# Altium schematic sheet USB_SATA.SchDoc
size B; SheetNumber: 6; SheetTotal: 11
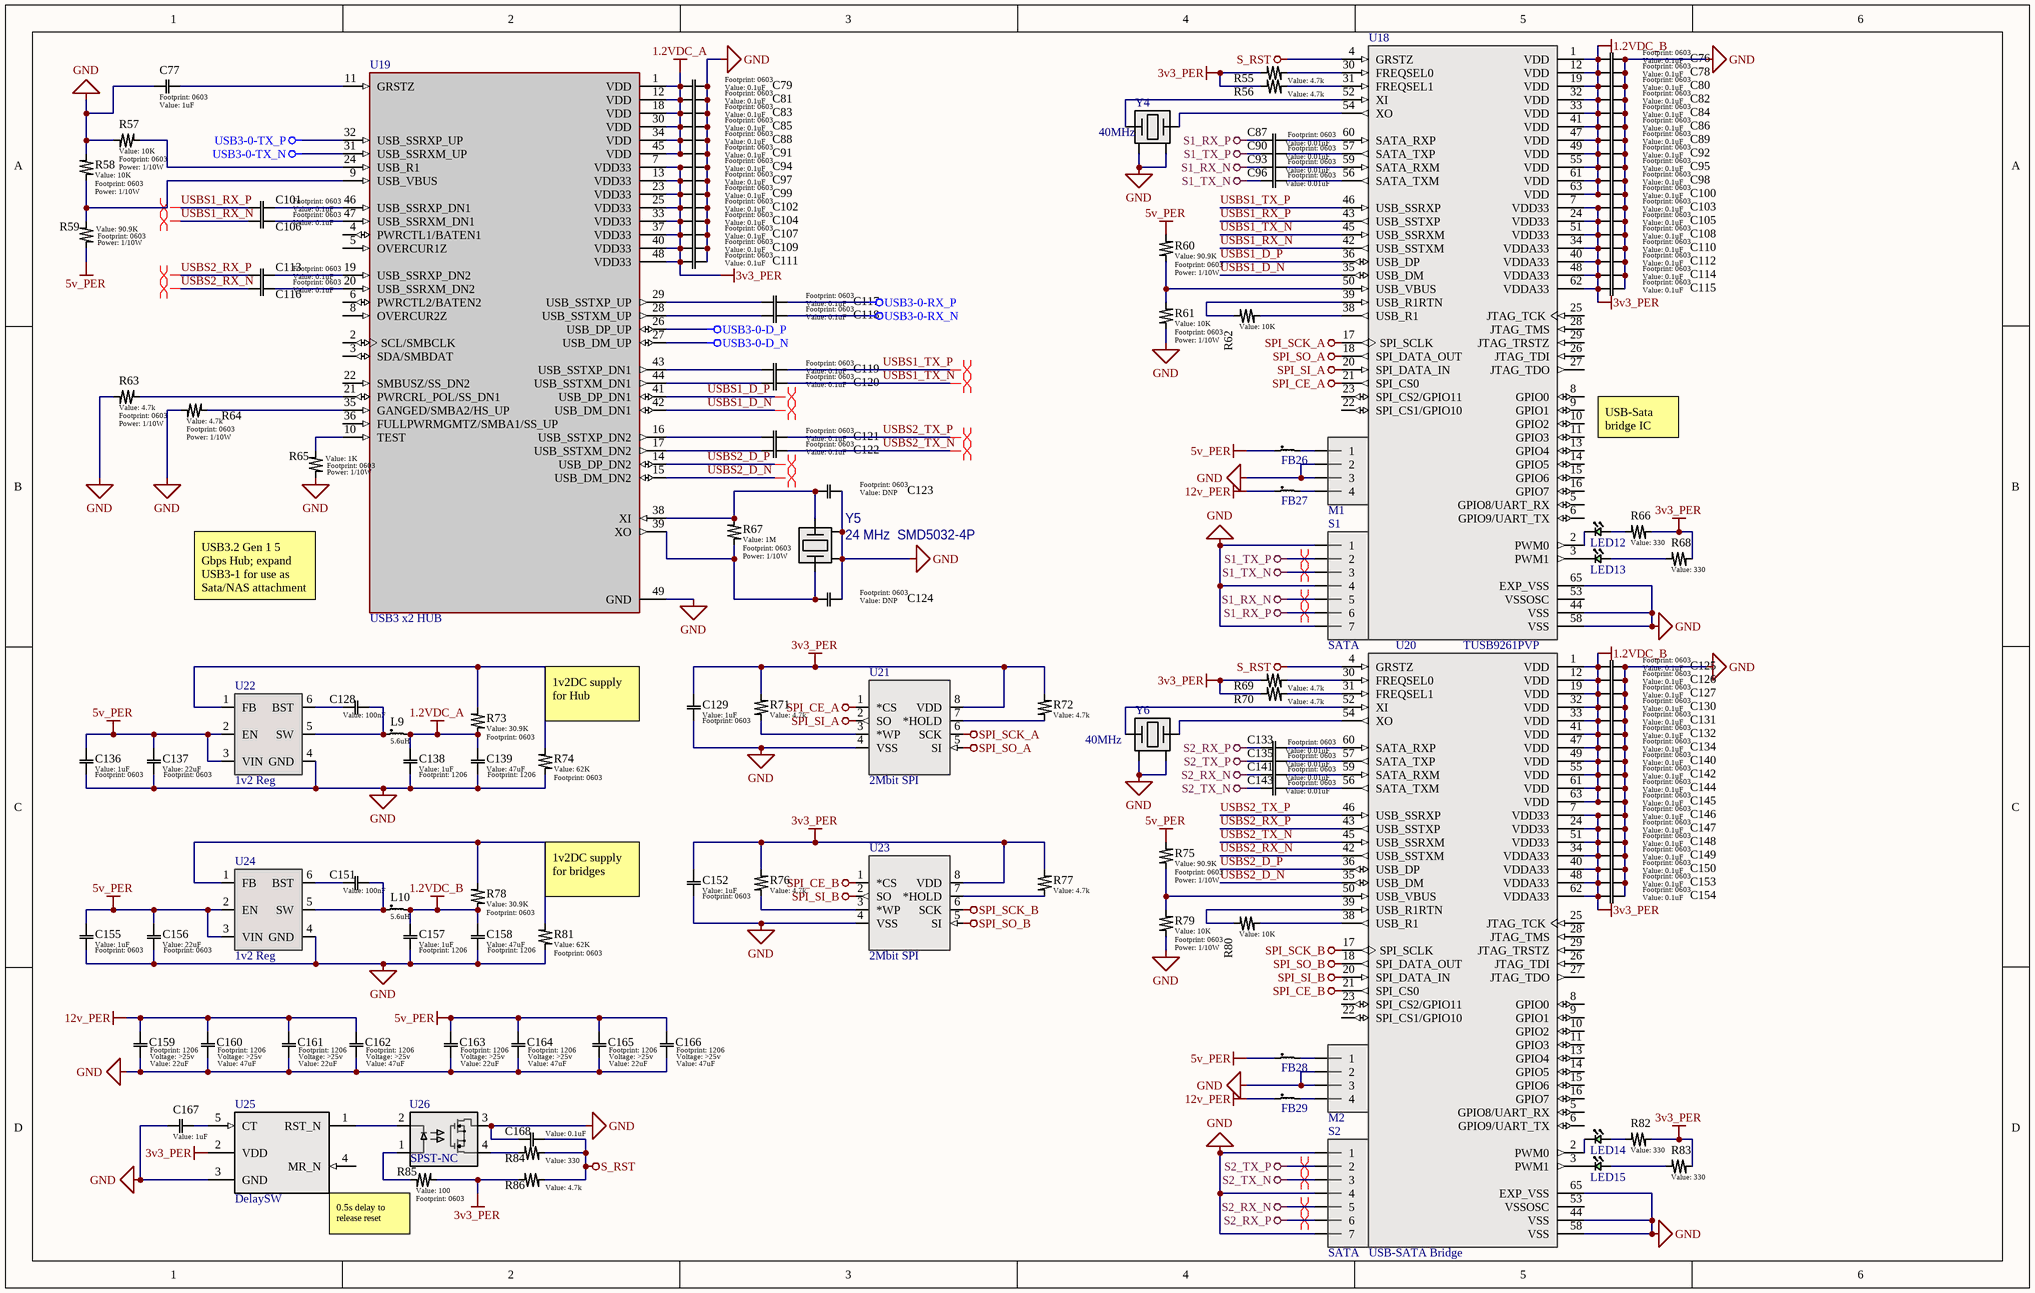
[diagram p0: USB_SATA.SchDoc]

## Parts
C76  value 0.1uF  [0603]  (hidden comment: Generic Capacitor)
C77  value 1uF  [0603]  (hidden comment: Generic Capacitor)
C78  value 0.1uF  [0603]  (hidden comment: Generic Capacitor)
C79  value 0.1uF  [0603]  (hidden comment: Generic Capacitor)
C80  value 0.1uF  [0603]  (hidden comment: Generic Capacitor)
C81  value 0.1uF  [0603]  (hidden comment: Generic Capacitor)
C82  value 0.1uF  [0603]  (hidden comment: Generic Capacitor)
C83  value 0.1uF  [0603]  (hidden comment: Generic Capacitor)
C84  value 0.1uF  [0603]  (hidden comment: Generic Capacitor)
C85  value 0.1uF  [0603]  (hidden comment: Generic Capacitor)
C86  value 0.1uF  [0603]  (hidden comment: Generic Capacitor)
C87  value 0.01uF  [0603]  (hidden comment: Generic Capacitor)
C88  value 0.1uF  [0603]  (hidden comment: Generic Capacitor)
C89  value 0.1uF  [0603]  (hidden comment: Generic Capacitor)
C90  value 0.01uF  [0603]  (hidden comment: Generic Capacitor)
C91  value 0.1uF  [0603]  (hidden comment: Generic Capacitor)
C92  value 0.1uF  [0603]  (hidden comment: Generic Capacitor)
C93  value 0.01uF  [0603]  (hidden comment: Generic Capacitor)
C94  value 0.1uF  [0603]  (hidden comment: Generic Capacitor)
C95  value 0.1uF  [0603]  (hidden comment: Generic Capacitor)
C96  value 0.01uF  [0603]  (hidden comment: Generic Capacitor)
C97  value 0.1uF  [0603]  (hidden comment: Generic Capacitor)
C98  value 0.1uF  [0603]  (hidden comment: Generic Capacitor)
C99  value 0.1uF  [0603]  (hidden comment: Generic Capacitor)
C100  value 0.1uF  [0603]  (hidden comment: Generic Capacitor)
C101  value 0.1uF  [0603]  (hidden comment: Generic Capacitor)
C102  value 0.1uF  [0603]  (hidden comment: Generic Capacitor)
C103  value 0.1uF  [0603]  (hidden comment: Generic Capacitor)
C104  value 0.1uF  [0603]  (hidden comment: Generic Capacitor)
C105  value 0.1uF  [0603]  (hidden comment: Generic Capacitor)
C106  value 0.1uF  [0603]  (hidden comment: Generic Capacitor)
C107  value 0.1uF  [0603]  (hidden comment: Generic Capacitor)
C108  value 0.1uF  [0603]  (hidden comment: Generic Capacitor)
C109  value 0.1uF  [0603]  (hidden comment: Generic Capacitor)
C110  value 0.1uF  [0603]  (hidden comment: Generic Capacitor)
C111  value 0.1uF  [0603]  (hidden comment: Generic Capacitor)
C112  value 0.1uF  [0603]  (hidden comment: Generic Capacitor)
C113  value 0.1uF  [0603]  (hidden comment: Generic Capacitor)
C114  value 0.1uF  [0603]  (hidden comment: Generic Capacitor)
C115  value 0.1uF  [0603]  (hidden comment: Generic Capacitor)
C116  value 0.1uF  [0603]  (hidden comment: Generic Capacitor)
C117  value 0.1uF  [0603]  (hidden comment: Generic Capacitor)
C118  value 0.1uF  [0603]  (hidden comment: Generic Capacitor)
C119  value 0.1uF  [0603]  (hidden comment: Generic Capacitor)
C120  value 0.1uF  [0603]  (hidden comment: Generic Capacitor)
C121  value 0.1uF  [0603]  (hidden comment: Generic Capacitor)
C122  value 0.1uF  [0603]  (hidden comment: Generic Capacitor)
C123  value DNP  [0603]  (hidden comment: Generic Capacitor)
C124  value DNP  [0603]  (hidden comment: Generic Capacitor)
C125  value 0.1uF  [0603]  (hidden comment: Generic Capacitor)
C126  value 0.1uF  [0603]  (hidden comment: Generic Capacitor)
C127  value 0.1uF  [0603]  (hidden comment: Generic Capacitor)
C128  value 100nF  [0603]  (hidden comment: Generic Capacitor)
C129  value 1uF  [0603]  (hidden comment: Generic Capacitor)
C130  value 0.1uF  [0603]  (hidden comment: Generic Capacitor)
C131  value 0.1uF  [0603]  (hidden comment: Generic Capacitor)
C132  value 0.1uF  [0603]  (hidden comment: Generic Capacitor)
C133  value 0.01uF  [0603]  (hidden comment: Generic Capacitor)
C134  value 0.1uF  [0603]  (hidden comment: Generic Capacitor)
C135  value 0.01uF  [0603]  (hidden comment: Generic Capacitor)
C136  value 1uF  [0603]  (hidden comment: Generic Capacitor)
C137  value 22uF  [0603]  (hidden comment: Generic Capacitor)
C138  value 1uF  [1206]  (hidden comment: Generic Capacitor)
C139  value 47uF  [1206]  (hidden comment: Generic Capacitor)
C140  value 0.1uF  [0603]  (hidden comment: Generic Capacitor)
C141  value 0.01uF  [0603]  (hidden comment: Generic Capacitor)
C142  value 0.1uF  [0603]  (hidden comment: Generic Capacitor)
C143  value 0.01uF  [0603]  (hidden comment: Generic Capacitor)
C144  value 0.1uF  [0603]  (hidden comment: Generic Capacitor)
C145  value 0.1uF  [0603]  (hidden comment: Generic Capacitor)
C146  value 0.1uF  [0603]  (hidden comment: Generic Capacitor)
C147  value 0.1uF  [0603]  (hidden comment: Generic Capacitor)
C148  value 0.1uF  [0603]  (hidden comment: Generic Capacitor)
C149  value 0.1uF  [0603]  (hidden comment: Generic Capacitor)
C150  value 0.1uF  [0603]  (hidden comment: Generic Capacitor)
C151  value 100nF  [0603]  (hidden comment: Generic Capacitor)
C152  value 1uF  [0603]  (hidden comment: Generic Capacitor)
C153  value 0.1uF  [0603]  (hidden comment: Generic Capacitor)
C154  value 0.1uF  [0603]  (hidden comment: Generic Capacitor)
C155  value 1uF  [0603]  (hidden comment: Generic Capacitor)
C156  value 22uF  [0603]  (hidden comment: Generic Capacitor)
C157  value 1uF  [1206]  (hidden comment: Generic Capacitor)
C158  value 47uF  [1206]  (hidden comment: Generic Capacitor)
C159  value 22uF  Voltage: >25v  [1206]  (hidden comment: Generic Capacitor)
C160  value 47uF  Voltage: >25v  [1206]  (hidden comment: Generic Capacitor)
C161  value 22uF  Voltage: >25v  [1206]  (hidden comment: Generic Capacitor)
C162  value 47uF  Voltage: >25v  [1206]  (hidden comment: Generic Capacitor)
C163  value 22uF  Voltage: >25v  [1206]  (hidden comment: Generic Capacitor)
C164  value 47uF  Voltage: >25v  [1206]  (hidden comment: Generic Capacitor)
C165  value 22uF  Voltage: >25v  [1206]  (hidden comment: Generic Capacitor)
C166  value 47uF  Voltage: >25v  [1206]  (hidden comment: Generic Capacitor)
C167  value 1uF  [0603]  (hidden comment: Generic Capacitor)
C168  value 0.1uF  [0603]  (hidden comment: Generic Capacitor)
FB26  1206 Ferrite  [1206]  (value not drawn)
FB27  1206 Ferrite  [1206]  (value not drawn)
FB28  1206 Ferrite  [1206]  (value not drawn)
FB29  1206 Ferrite  [1206]  (value not drawn)
L9  5.6uH  [TMPC0402HP]
L10  5.6uH  [TMPC0402HP]
LED12  LTST-C191KGKT  [0603 (1608 Metric) Concave]  (value not drawn)
LED13  LTST-C191KGKT  [0603 (1608 Metric) Concave]  (value not drawn)
LED14  LTST-C191KGKT  [0603 (1608 Metric) Concave]  (value not drawn)
LED15  LTST-C191KGKT  [0603 (1608 Metric) Concave]  (value not drawn)
M1  MATE-n-Lock  [794287-1]  (value not drawn)
M2  MATE-n-Lock  [794287-1]  (value not drawn)
R55  value 4.7k  [0603]  (hidden comment: Generic Resistor)
R56  value 4.7k  [0603]  (hidden comment: Generic Resistor)
R57  value 10K  Power: 1/10W  [0603]  (hidden comment: Generic Resistor)
R58  value 10K  Power: 1/10W  [0603]  (hidden comment: Generic Resistor)
R59  value 90.9K  Power: 1/10W  [0603]  (hidden comment: Generic Resistor)
R60  value 90.9K  Power: 1/10W  [0603]  (hidden comment: Generic Resistor)
R61  value 10K  Power: 1/10W  [0603]  (hidden comment: Generic Resistor)
R62  value 10K  [0603]  (hidden comment: Generic Resistor)
R63  value 4.7k  Power: 1/10W  [0603]  (hidden comment: Generic Resistor)
R64  value 4.7k  Power: 1/10W  [0603]  (hidden comment: Generic Resistor)
R65  value 1K  Power: 1/10W  [0603]  (hidden comment: Generic Resistor)
R66  value 330  [0603]  (hidden comment: Generic Resistor)
R67  value 1M  Power: 1/10W  [0603]  (hidden comment: Generic Resistor)
R68  value 330  [0603]  (hidden comment: Generic Resistor)
R69  value 4.7k  [0603]  (hidden comment: Generic Resistor)
R70  value 4.7k  [0603]  (hidden comment: Generic Resistor)
R71  value 4.7k  [0603]  (hidden comment: Generic Resistor)
R72  value 4.7k  [0603]  (hidden comment: Generic Resistor)
R73  value 30.9K  [0603]  (hidden comment: Generic Resistor)
R74  value 62K  [0603]  (hidden comment: Generic Resistor)
R75  value 90.9K  Power: 1/10W  [0603]  (hidden comment: Generic Resistor)
R76  value 4.7k  [0603]  (hidden comment: Generic Resistor)
R77  value 4.7k  [0603]  (hidden comment: Generic Resistor)
R78  value 30.9K  [0603]  (hidden comment: Generic Resistor)
R79  value 10K  Power: 1/10W  [0603]  (hidden comment: Generic Resistor)
R80  value 10K  [0603]  (hidden comment: Generic Resistor)
R81  value 62K  [0603]  (hidden comment: Generic Resistor)
R82  value 330  [0603]  (hidden comment: Generic Resistor)
R83  value 330  [0603]  (hidden comment: Generic Resistor)
R84  value 330  [0603]  (hidden comment: Generic Resistor)
R85  value 100  [0603]  (hidden comment: Generic Resistor)
R86  value 4.7k  [0603]  (hidden comment: Generic Resistor)
S1  SATA  [67800-8025]
S2  SATA  [67800-8025]
U18  USB-SATA Bridge  [64-HTQFP (7x7)]  (value not drawn)
U19  USB3 x2 HUB  [HTQFP-48(7x7)]
U20  USB-SATA Bridge  [64-HTQFP (7x7)]
U21  2Mbit SPI  [8-SOIC (0.154", 3.90mm Width)]
U22  1v2 Reg  [TSOT-23-6]
U23  2Mbit SPI  [8-SOIC (0.154", 3.90mm Width)]
U24  1v2 Reg  [TSOT-23-6]
U25  DelaySW  [TSOT-23-5]
U26  SPST-NC  [4-SOP]
Y4  40MHz  [SMD3225-4P]
Y5  24 MHz  SMD5032-4P  [ECS-240-18-30BQ-DS]
Y6  40MHz  [SMD3225-4P]

## Nets
1.2VDC_A: C79.2 C81.2 C83.2 C85.2 C88.2 C91.2 C138.1 C139.1 L9.2 R73.1 U19.1(VDD) U19.12(VDD) U19.18(VDD) U19.30(VDD) U19.34(VDD) U19.45(VDD)
1.2VDC_B: C76.2 C78.2 C80.2 C82.2 C84.2 C86.2 C89.2 C92.2 C95.2 C98.2 C100.2 C125.2 C126.2 C127.2 C130.2 C131.2 C132.2 C134.2 C140.2 C142.2 C144.2 C145.2 C157.1 C158.1 L10.2 R78.1 U18.1(VDD) U18.12(VDD) U18.19(VDD) U18.32(VDD) U18.33(VDD) U18.41(VDD) U18.47(VDD) U18.49(VDD) U18.55(VDD) U18.61(VDD) U18.63(VDD) U20.1(VDD) U20.12(VDD) U20.19(VDD) U20.32(VDD) U20.33(VDD) U20.41(VDD) U20.47(VDD) U20.49(VDD) U20.55(VDD) U20.61(VDD) U20.63(VDD)
3v3_PER: C94.2 C97.2 C99.2 C102.2 C103.2 C104.2 C105.2 C107.2 C108.2 C109.2 C110.2 C111.2 C112.2 C114.2 C115.2 C129.1 C146.2 C147.2 C148.2 C149.2 C150.2 C152.1 C153.2 C154.2 R55.1 R56.1 R66.2 R68.2 R69.1 R70.1 R71.1 R72.1 R76.1 R77.1 R82.2 R83.2 R85.2 R86.1 U18.7(VDD33) U18.24(VDD33) U18.34(VDDA33) U18.40(VDDA33) U18.48(VDDA33) U18.51(VDD33) U18.62(VDDA33) U19.7(VDD33) U19.13(VDD33) U19.23(VDD33) U19.25(VDD33) U19.33(VDD33) U19.37(VDD33) U19.40(VDD33) U19.48(VDD33) U20.7(VDD33) U20.24(VDD33) U20.34(VDDA33) U20.40(VDDA33) U20.48(VDDA33) U20.51(VDD33) U20.62(VDDA33) U21.8(VDD) U23.8(VDD) U25.2(VDD)
5v_PER: C136.1 C137.1 C155.1 C156.1 C163.1 C164.1 C165.1 C166.1 FB26.1 FB28.1 R59.1 R60.1 R75.1 U22.2(EN) U22.3(VIN) U24.2(EN) U24.3(VIN)
12v_PER: C159.1 C160.1 C161.1 C162.1 FB27.1 FB29.1
GND: C76.1 C77.1 C78.1 C79.1 C80.1 C81.1 C82.1 C83.1 C84.1 C85.1 C86.1 C88.1 C89.1 C91.1 C92.1 C94.1 C95.1 C97.1 C98.1 C99.1 C100.1 C102.1 C103.1 C104.1 C105.1 C107.1 C108.1 C109.1 C110.1 C111.1 C112.1 C114.1 C115.1 C123.1 C124.1 C125.1 C126.1 C127.1 C129.2 C130.1 C131.1 C132.1 C134.1 C136.2 C137.2 C138.2 C139.2 C140.1 C142.1 C144.1 C145.1 C146.1 C147.1 C148.1 C149.1 C150.1 C152.2 C153.1 C154.1 C155.2 C156.2 C157.2 C158.2 C159.2 C160.2 C161.2 C162.2 C163.2 C164.2 C165.2 C166.2 C167.2 C168.1 M1.2 M1.3 M2.2 M2.3 R57.1 R58.1 R61.1 R63.1 R64.1 R65.1 R74.1 R79.1 R81.1 S1.1 S1.4 S1.7 S2.1 S2.4 S2.7 U18.44(VSS) U18.58(VSS) U18.65(EXP_VSS) U19.49(GND) U20.44(VSS) U20.58(VSS) U20.65(EXP_VSS) U21.4(VSS) U22.4(GND) U23.4(VSS) U24.4(GND) U25.3(GND) U26.3 Y4.2(GND) Y4.4(GND) Y5.2(GND) Y5.4(GND) Y6.2(GND) Y6.4(GND)
S1_RX_N: C93.2 S1.5
S1_RX_P: C87.2 S1.6
S1_TX_N: C96.2 S1.3
S1_TX_P: C90.2 S1.2
S2_RX_N: C141.2 S2.5
S2_RX_P: C133.2 S2.6
S2_TX_N: C143.2 S2.3
S2_TX_P: C135.2 S2.2
S_RST: C168.2 R84.2 R86.2 U18.4(GRSTZ) U20.4(GRSTZ)
SPI_CE_A: U18.21(SPI_CS0) U21.1(*CS)
SPI_CE_B: U20.21(SPI_CS0) U23.1(*CS)
SPI_SCK_A: U18.17(SPI_SCLK) U21.6(SCK)
SPI_SCK_B: U20.17(SPI_SCLK) U23.6(SCK)
SPI_SI_A: U18.20(SPI_DATA_IN) U21.2(SO)
SPI_SI_B: U20.20(SPI_DATA_IN) U23.2(SO)
SPI_SO_A: U18.18(SPI_DATA_OUT) U21.5(SI)
SPI_SO_B: U20.18(SPI_DATA_OUT) U23.5(SI)
USB3-0-D_N: U19.27(USB_DM_UP)
USB3-0-D_P: U19.26(USB_DP_UP)
USB3-0-RX_N: C118.1
USB3-0-RX_P: C117.1
USB3-0-TX_N: U19.31(USB_SSRXM_UP)
USB3-0-TX_P: U19.32(USB_SSRXP_UP)
USBS1_D_N: U18.35(USB_DM) U19.42(USB_DM_DN1)
USBS1_D_P: U18.36(USB_DP) U19.41(USB_DP_DN1)
USBS1_RX_N: C106.2 U18.42(USB_SSTXM)
USBS1_RX_P: C101.2 U18.43(USB_SSTXP)
USBS1_TX_N: C120.1 U18.45(USB_SSRXM)
USBS1_TX_P: C119.1 U18.46(USB_SSRXP)
USBS2_D_N: U19.15(USB_DM_DN2) U20.35(USB_DM)
USBS2_D_P: U19.14(USB_DP_DN2) U20.36(USB_DP)
USBS2_RX_N: C116.2 U20.42(USB_SSTXM)
USBS2_RX_P: C113.2 U20.43(USB_SSTXP)
USBS2_TX_N: C122.1 U20.45(USB_SSRXM)
USBS2_TX_P: C121.1 U20.46(USB_SSRXP)
NetC77_2: C77.2 U19.11(GRSTZ)
NetC87_1: C87.1 U18.60(SATA_RXP)
NetC90_1: C90.1 U18.57(SATA_TXP)
NetC93_1: C93.1 U18.59(SATA_RXM)
NetC96_1: C96.1 U18.56(SATA_TXM)
NetC101_1: C101.1 U19.46(USB_SSRXP_DN1)
NetC106_1: C106.1 U19.47(USB_SSRXM_DN1)
NetC113_1: C113.1 U19.19(USB_SSRXP_DN2)
NetC116_1: C116.1 U19.20(USB_SSRXM_DN2)
NetC117_2: C117.2 U19.29(USB_SSTXP_UP)
NetC118_2: C118.2 U19.28(USB_SSTXM_UP)
NetC119_2: C119.2 U19.43(USB_SSTXP_DN1)
NetC120_2: C120.2 U19.44(USB_SSTXM_DN1)
NetC121_2: C121.2 U19.16(USB_SSTXP_DN2)
NetC122_2: C122.2 U19.17(USB_SSTXM_DN2)
NetC123_2: C123.2 R67.1 U19.38(XI) Y5.3
NetC124_2: C124.2 R67.2 U19.39(XO) Y5.1
NetC128_1: C128.1 U22.6(BST)
NetC128_2: C128.2 L9.1 U22.5(SW)
NetC133_1: C133.1 U20.60(SATA_RXP)
NetC135_1: C135.1 U20.57(SATA_TXP)
NetC141_1: C141.1 U20.59(SATA_RXM)
NetC143_1: C143.1 U20.56(SATA_TXM)
NetC151_1: C151.1 U24.6(BST)
NetC151_2: C151.2 L10.1 U24.5(SW)
NetC167_1: C167.1 U25.5(CT)
NetFB26_2: FB26.2 M1.1
NetFB27_2: FB27.2 M1.4
NetFB28_2: FB28.2 M2.1
NetFB29_2: FB29.2 M2.4
NetLED12_1: LED12.1(Cathode) U18.2(PWM0)
NetLED12_2: LED12.2(Anode) R66.1
NetLED13_1: LED13.1(Cathode) U18.3(PWM1)
NetLED13_2: LED13.2(Anode) R68.1
NetLED14_1: LED14.1(Cathode) U20.2(PWM0)
NetLED14_2: LED14.2(Anode) R82.1
NetLED15_1: LED15.1(Cathode) U20.3(PWM1)
NetLED15_2: LED15.2(Anode) R83.1
NetR55_2: R55.2 U18.30(FREQSEL0)
NetR56_2: R56.2 U18.31(FREQSEL1)
NetR57_2: R57.2 U19.24(USB_R1)
NetR58_2: R58.2 R59.2 U19.9(USB_VBUS)
NetR60_2: R60.2 R61.2 U18.50(USB_VBUS)
NetR62_1: R62.1 U18.39(USB_R1RTN)
NetR62_2: R62.2 U18.38(USB_R1)
NetR63_2: R63.2 U19.21(PWRCRL_POL/SS_DN1)
NetR64_2: R64.2 U19.35(GANGED/SMBA2/HS_UP)
NetR65_2: R65.2 U19.10(TEST)
NetR69_2: R69.2 U20.30(FREQSEL0)
NetR70_2: R70.2 U20.31(FREQSEL1)
NetR71_2: R71.2 U21.3(*WP)
NetR72_2: R72.2 U21.7(*HOLD)
NetR73_2: R73.2 R74.2 U22.1(FB)
NetR75_2: R75.2 R79.2 U20.50(USB_VBUS)
NetR76_2: R76.2 U23.3(*WP)
NetR77_2: R77.2 U23.7(*HOLD)
NetR78_2: R78.2 R81.2 U24.1(FB)
NetR80_1: R80.1 U20.39(USB_R1RTN)
NetR80_2: R80.2 U20.38(USB_R1)
NetR84_1: R84.1 U26.4
NetR85_1: R85.1 U26.1
NetU18_52: U18.52(XI) Y4.3
NetU18_54: U18.54(XO) Y4.1
NetU20_52: U20.52(XI) Y6.3
NetU20_54: U20.54(XO) Y6.1
NetU25_1: U25.1(RST_N) U26.2

Not connected (* = marked no-connect by the designer): U18 5(GPIO8/UART_RX) 6(GPIO9/UART_TX) 8(GPIO0) 9(GPIO1) 10(GPIO2) 11(GPIO3) 13(GPIO4) 14(GPIO5) 15(GPIO6) 16(GPIO7) 22(SPI_CS1/GPIO10) 23(SPI_CS2/GPIO11) 25(JTAG_TCK) 26(JTAG_TDI) 27(JTAG_TDO) 28(JTAG_TMS) 29(JTAG_TRSTZ) 53(VSSOSC); U19 2(SCL/SMBCLK) 3(SDA/SMBDAT) 4(PWRCTL1/BATEN1) 5(OVERCUR1Z) 6(PWRCTL2/BATEN2) 8(OVERCUR2Z) 22(SMBUSZ/SS_DN2) 36(FULLPWRMGMTZ/SMBA1/SS_UP); U20 5(GPIO8/UART_RX) 6(GPIO9/UART_TX) 8(GPIO0) 9(GPIO1) 10(GPIO2) 11(GPIO3) 13(GPIO4) 14(GPIO5) 15(GPIO6) 16(GPIO7) 22(SPI_CS1/GPIO10) 23(SPI_CS2/GPIO11) 25(JTAG_TCK) 26(JTAG_TDI) 27(JTAG_TDO) 28(JTAG_TMS) 29(JTAG_TRSTZ) 53(VSSOSC); U25 4(MR_N)

## Layout directives
differential pair: S1_RX_N, S1_RX_P, S1_TX_N, S1_TX_P, S2_RX_N, S2_RX_P, S2_TX_N, S2_TX_P, USBS1_D_N, USBS1_D_P, USBS1_RX_N, USBS1_RX_P, USBS1_TX_N, USBS1_TX_P, USBS2_D_N, USBS2_D_P, USBS2_RX_N, USBS2_RX_P, USBS2_TX_N, USBS2_TX_P

## Notes on the sheet
- (near U18) USB-Sata bridge IC
- USB3.2 Gen 1 5
  Gbps Hub; expand USB3-1 for use as Sata/NAS attachment
- 1v2DC supply for Hub
- 1v2DC supply for bridges
- 0.5s delay to release reset
- REV
- REVISIONS
- DATE
- DESCRIPTION
- BY
- UNLESS OTHERWISE SPECIFIED, DRAWING DEFINITIONS AND TOLERANCES SHALL BE FOUND UNDER SUPPLIER STANDARDS SS-001. THIS PART AND ALL COMPONENTS OF IT MUST BE RoHS & REACH COMPLIANT. A CERTIFICATE OF COMPLIANCE MUST BE PROVIDED UPON REQUEST.
- ALL INFORMATION ON THIS DOCUMENT IS THE SOLE PROPERTY OF GAMBER-JOHNSON AND SHALL NOT BE COPIED, REPRODUCED, USED OR DISCLOSED IN WHOLE OR IN PART WITHOUT THE WRITTEN CONSENT OF GAMBER-JOHNSON
- TOLERANCES
  .00 ± .060
  .000 ± .020
  .0000 ± .005
  ANGELS ± 1°
- DRAWN BY:
- PROJECT NUMBER:
- SHEET TITLE:
- SHEET
- OF
- DATE:
- LOCATION:
- ASSEMBLY NUMBER
- SIZE
- GAMBER-JOHNSON LLC
  5001 JOERNS DR.
  STEVENS POINT, WI 54481
  +1 (715) 344-5209
- B

## Library data of the parts
C76 C78-C122 C125-C127 C130-C135 C140-C150 C153 C154 C167 C168 = Generic Capacitor: Voltage: 10V; Tolerance: 10%
C77 C123 C124 C128 C129 C136-C139 C151 C152 C155-C158 = Generic Capacitor: Voltage: >10V; Tolerance: 10%
C159-C166 = Generic Capacitor: Tolerance: 20%
FB26-FB29 = HI1206T161R-10: 160 Ohms @ 100MHz 1 Power, Signal Line Ferrite Bead 1206 (3216 Metric) 6A 18mOhm; Manufacturer 1: Laird Steward; DC Resistance (DCR): 18mR; Number of Lines: 1; Impedance: 160R; Supplier 1: Digi-Key; Manufacturer Part Number 1: HI1206T161R-10; RoHS: Yes; Category: Fixed Inductors; Stock 1: 250713; Pricing 1: 1=0.20000, 10=0.15600, 25=0.12920, 50=0.11140, 100=0.10020, 250=0.08464, 500=0.07572, 1000=0.06458 (USD); Mount: Surface Mount; Case/Package: 1206; Weight: 0.0136oz; Case Code (Metric): 3216; Case Code (Imperial): 1206; Core Material: Ferrite; Material: Ferrite; Min Operating Temperature: -40°C; Max Operating Temperature: 125°C; Package Quantity: 1; Packaging: Tape and Reel; Max Current Rating: 6A; Current Rating: 6A; Max DC Current: 6A; Termination: SMD/SMT; Frequency: 100MHz; Test Frequency: 100MHz; Length: 3.2mm; Height: 0.071inch; Width: 0.063inch; Depth: 1.8mm; Lead Free: Lead Free; REACH SVHC: Unknown; ComponentLink1URL: https://datasheet.ciiva.com/22622/1685743-22622771.pdf?src-supplier=Element14; ComponentLink1Description: https://datasheet.ciiva.com/22622/1685743-22622771.pdf?src-supplier=Element14; ComponentLink2URL: https://datasheet.ciiva.com/16714/70065439-16714326.pdf?src-supplier=Allied+Electronics; ComponentLink2Description: https://datasheet.ciiva.com/16714/70065439-16714326.pdf?src-supplier=Allied+Electronics; Supplier Part Number 1: 240-2411-1-ND; LCSC PN: C2926396
L9 L10 = TMPC0402HP-5R6MG-Z02: 2A 5.6uH ±20% SMD Power Inductor; LCSC PN: C357137; Supplier 1: Digi-Key; Supplier Part Number 1: 732-3339-1-ND
LED12-LED15 = CMP-013-000000-1: LED Uni-Color Green 574nm 2-Pin Chip LED T/R; Manufacturer 1: Vishay Lite-On; Number of Elements: 1; Viewing Angle: 130°; Lens Transparency: Clear; Power Dissipation: 75mW; Test Current: 20mA; Lens Style: Rectangular,Colorless; Reverse Voltage: 5V; Lens Color: Colorless; Forward Current: 30mA; Dominant Wavelength: 571nm; Forward Voltage: 2V; Luminous Intensity: 35mcd; Case Code (Imperial): 0603; Width: 0.8mm; Depth: 0.8mm; Case Code (Metric): 1608; Packaging: Tape and Reel; Number of LEDs: 1; Lead Free: Lead Free; Package Quantity: 1; Illumination Color: Green; Design Item ID: LTST-C191KGKT; Color: Green; Mount: Surface Mount; Source: Diodes.SchLib; Radiation Hardening: No; Wavelength: 574nm; RoHS: Yes; Max Power Dissipation: 75mW; RoHS Compliant: Yes; Power Rating: 75mW; Case/Package: 0603; Length: 1.6mm; Component Type: Standard; Number of Pins: 2; Height: 0.55mm; Stock 1: 4150; Pin Count: 2; ComponentLink1Description: https://datasheet.ciiva.com/2109/ltst-c191kgkt-2109973.pdf?src-supplier=Digi-Key; Manufacturer Part Number 1: LTST-C191KGKT; Category: LEDs; Min Operating Temperature: -55°C; ComponentLink1URL: https://datasheet.ciiva.com/2109/ltst-c191kgkt-2109973.pdf?src-supplier=Digi-Key; Max Operating Temperature: 85°C; Pricing 1: 50=0.14800, 250=0.06800, 500=0.06400, 1250=0.05400, 2500=0.05100 (USD)
M1 M2 = 794287-1: 4 Position Header Connector 0.200" (5.08mm) Through Hole Tin; Mfr_Name: TE Connectivity; TYPE: -; RefDes: RefDes
R55 R56 R62 R66 R68-R74 R76-R78 R80-R86 = Generic Resistor: Tolerance: 1%; Power: 1/10W
R57-R61 R63-R65 R67 R75 R79 = Generic Resistor: Tolerance: 1%
S1 S2 = 67800-8025: 7 Position SATA Header, Shrouded Connector Solder Through Hole; Mfr_Name: Molex Connector Corporation; RefDes: RefDes; Type: Type; LCSC PN: C7500843
U18 U20 = TUSB9261PVP: HDD, CD, DVD Drive Interface 64-HTQFP _7x7_; MF: Texas Instruments; Package: HTQFP-64 Texas Instruments; Digi-Key_Part_Number: 296-28827-ND; MP: TUSB9261PVP; SnapEDA_Link: https://www.snapeda.com/parts/TUSB9261PVP/Texas%20Instruments/view-part/1218116/?ref=snap; Digi-Key_Purchase_URL: https://www.digikey.com/product-detail/en/texas-instruments/TUSB9261PVP/296-28827-ND/2674328?utm_source=snapeda&utm_medium=aggregator&utm_campaign=symbol; Value: *; LCSC PN: C913832
U19 = TUSB8020BPHP: USB Hub Controller USB 3.0; LCSC PN: C205982; Supplier 1: Mouser; Supplier Part Number 1: 595-TUSB8020BPHP
U21 U23 = LE25U20AMB-AH: IC FLASH 2MBIT SPI 30MHZ 8SOP; Mfr_Name: onsemi; RefDes: RefDes; Type: Type; LCSC PN: C409019
U22 U24 = AP63201WU-7: Step-down type Adjustable 2A 1.2V~12V 3.8V~32V TSOT-23-6 DC-DC Converter; LCSC PN: C2071044; Supplier 1: Future Electronics; Supplier Part Number 1: 5109504
U25 = TPS3840DL22DBVR: Supervisor Open Drain or Open Collector 1 Channel SOT-23-5 / 2.2V Threshold; Mfr_Name: Texas Instruments; TYPE: TYPE; RefDes: RefDes; LCSC PN: C2867913; Supplier 1: Mouser; Supplier Part Number 1: 595-TPS3840DL22DBVR
U26 = CPC1117N: SSR RELAY SPST-NC 400MA 0-60V; Mfr_Name: Littelfuse Inc; RefDes: RefDes; Type: Type; LCSC PN: C150424
Y4 Y6 = L327S400H11L: 40MHz Surface Mount Crystal 10pF ±10ppm SMD3225-4P Crystal; LCSC PN: C5261245
Y5 = CMP-018-000001-1: 24 MHz ±30ppm Crystal 18pF 30 Ohms 4-SMD, No Lead; Pin Count: 4; Design Item ID: ECS-240-18-30BQ-DS; Component Type: Standard; Source: Misc ICs.SchLib; LCSC PN: C251601